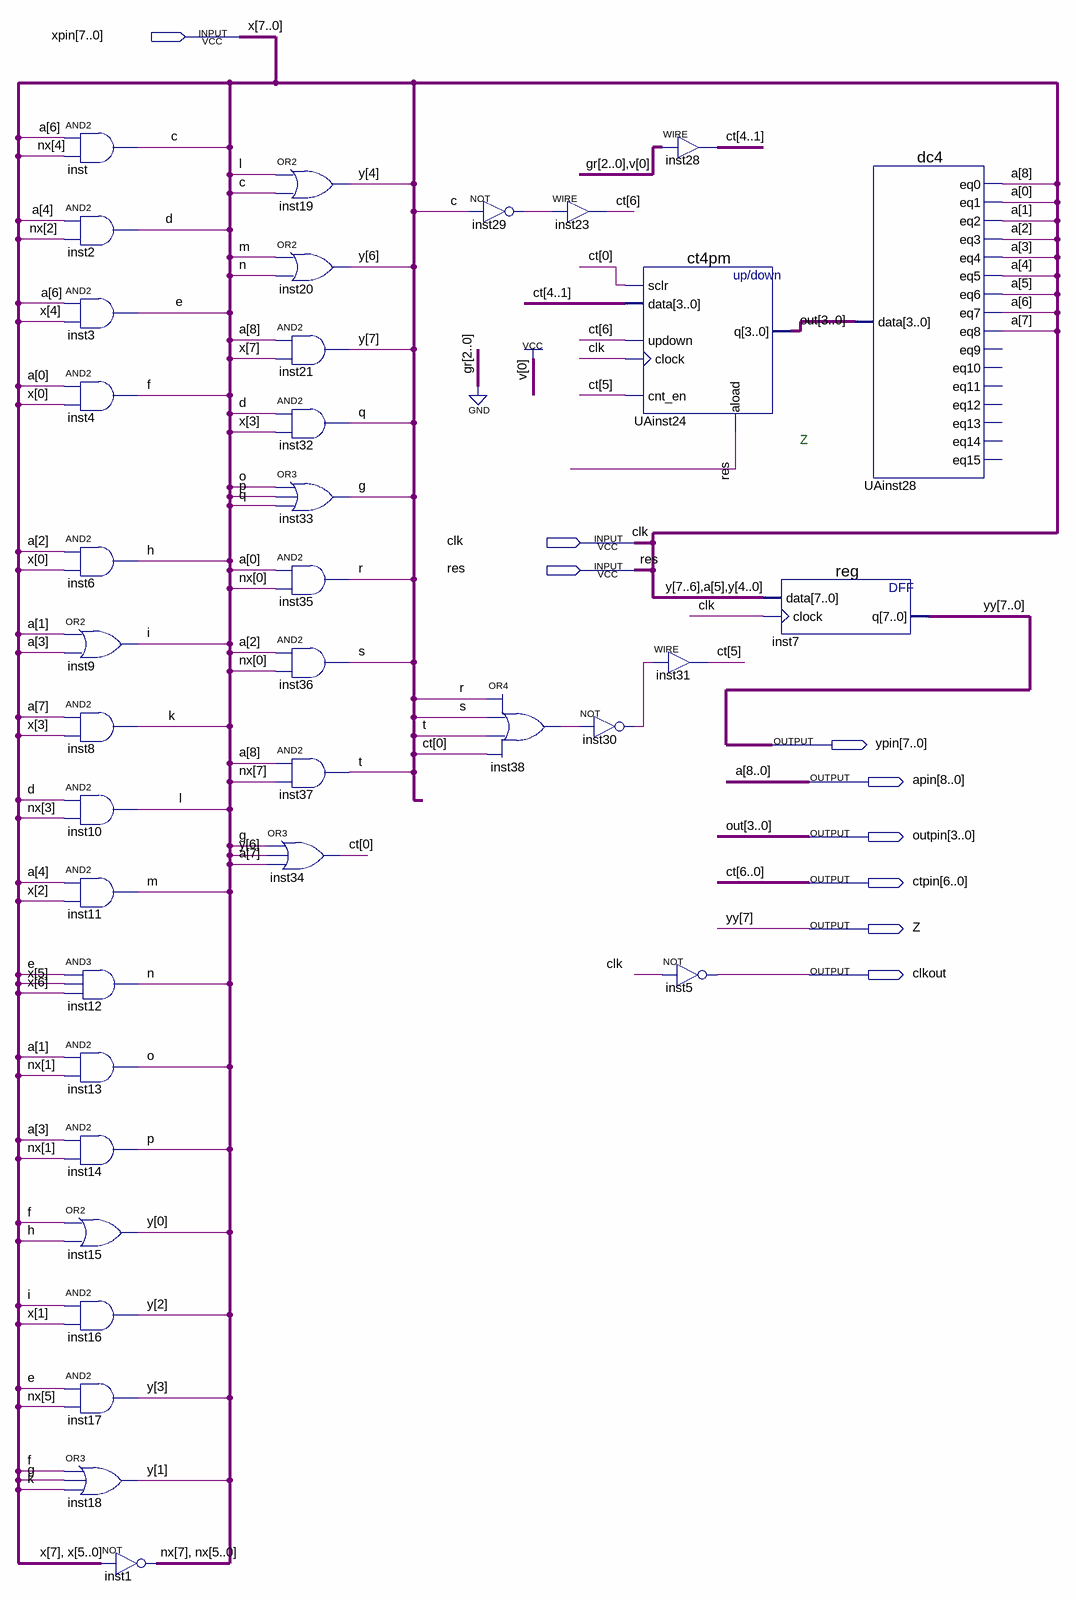
[diagram p0: schematic sheet]
// Quartus schematic UA.bdf as structural Verilog: 36 symbols, 9 pins
module UA (
  input  [7:0] xpin,
  input  clk,
  input  res,
  output [7:0] ypin,
  output [8:0] apin,
  output [3:0] outpin,
  output [6:0] ctpin,
  output Z,
  output clkout
);

  wire c, d, e, f, g, h, i, inst29_out, inst30_out, inst38_out, k, l, m, n, o, p, q, r, s, t;
  wire [7:0] nx, y;

  and inst (c, apin[6], nx[4]);
  and inst2 (d, apin[4], nx[2]);
  and inst3 (e, apin[6], xpin[4]);
  and inst4 (f, apin[0], xpin[0]);
  and inst6 (h, apin[2], xpin[0]);
  or inst9 (i, apin[1], apin[3]);
  and inst8 (k, apin[7], xpin[3]);
  and inst10 (l, d, nx[3]);
  and inst11 (m, apin[4], xpin[2]);
  and inst12 (n, e, xpin[5], xpin[6]);
  and inst13 (o, apin[1], nx[1]);
  and inst14 (p, apin[3], nx[1]);
  or inst15 (y[0], f, h);
  and inst16 (y[2], i, xpin[1]);
  and inst17 (y[3], e, nx[5]);
  or inst18 (y[1], f, g, k);
  assign {nx[7], nx[5:0]} = ~{xpin[7], xpin[5:0]};  // NOT inst1, 7 bits wide
  or inst19 (y[4], l, c);
  or inst20 (y[6], m, n);
  and inst21 (y[7], apin[8], xpin[7]);
  and inst32 (q, d, xpin[3]);
  or inst33 (g, o, p, q);
  and inst35 (r, apin[0], nx[0]);
  and inst36 (s, apin[2], nx[0]);
  and inst37 (t, apin[8], nx[7]);
  or inst34 (ctpin[0], g, y[6], apin[7]);
  not inst29 (inst29_out, c);
  assign ctpin[6] = inst29_out;  // WIRE inst23
  or inst38 (inst38_out, r, s, t, ctpin[0]);
  ct4pm UAinst24 (
    .sclr(ctpin[0]), .data(ctpin[4:1]), .updown(ctpin[6]), .clock(clk), .cnt_en(ctpin[5]), .aload(res),
    .q(outpin));
  not inst30 (inst30_out, inst38_out);
  assign ctpin[4:1] = 4'b0001;  // WIRE inst28
  assign ctpin[5] = inst30_out;  // WIRE inst31
  not inst5 (clkout, clk);
  \reg  inst7 (.data({y[7:6], apin[5], y[4:0]}), .clock(clk), .q(ypin));
  dc4 UAinst28 (
    .data(outpin), .eq0(apin[8]), .eq1(apin[0]), .eq2(apin[1]), .eq3(apin[2]), .eq4(apin[3]), .eq5(apin[4]),
    .eq6(apin[5]), .eq7(apin[6]), .eq8(apin[7]));  // open: eq9, eq10, eq11, eq12, eq13, eq14, eq15

  assign Z = ypin[7];

  // Other names for the same wires on the sheet: a[8:0] = apin; ct[6:0] = ctpin; out[3:0] = outpin; x[7:0] = xpin;
  //   yy[7:0] = ypin

  // Notes on the sheet:
  //   Z
endmodule
